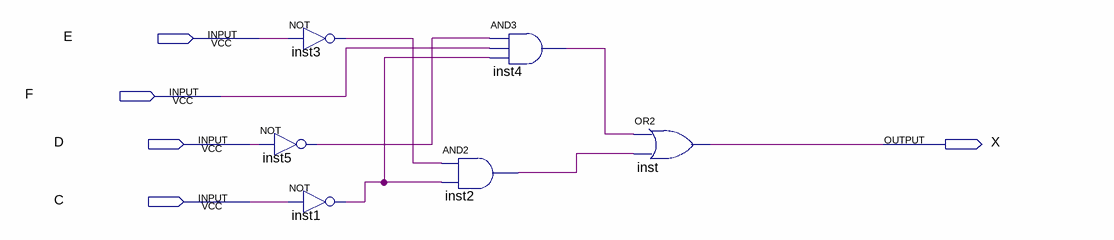
[diagram p0: schematic sheet]
// Quartus schematic KOMa1b1.bdf as structural Verilog: 6 symbols, 5 pins
module KOMa1b1 (
  input  E,
  input  F,
  input  D,
  input  C,
  output X
);

  wire inst1_out, inst2_out, inst3_out, inst4_out, inst5_out;

  not inst3 (inst3_out, E);
  not inst5 (inst5_out, D);
  not inst1 (inst1_out, C);
  and inst2 (inst2_out, inst3_out, inst1_out);
  and inst4 (inst4_out, inst5_out, F, inst1_out);
  or inst (X, inst4_out, inst2_out);
endmodule
